# EasyEDA Pro project multi_port.eprj, board PCB1
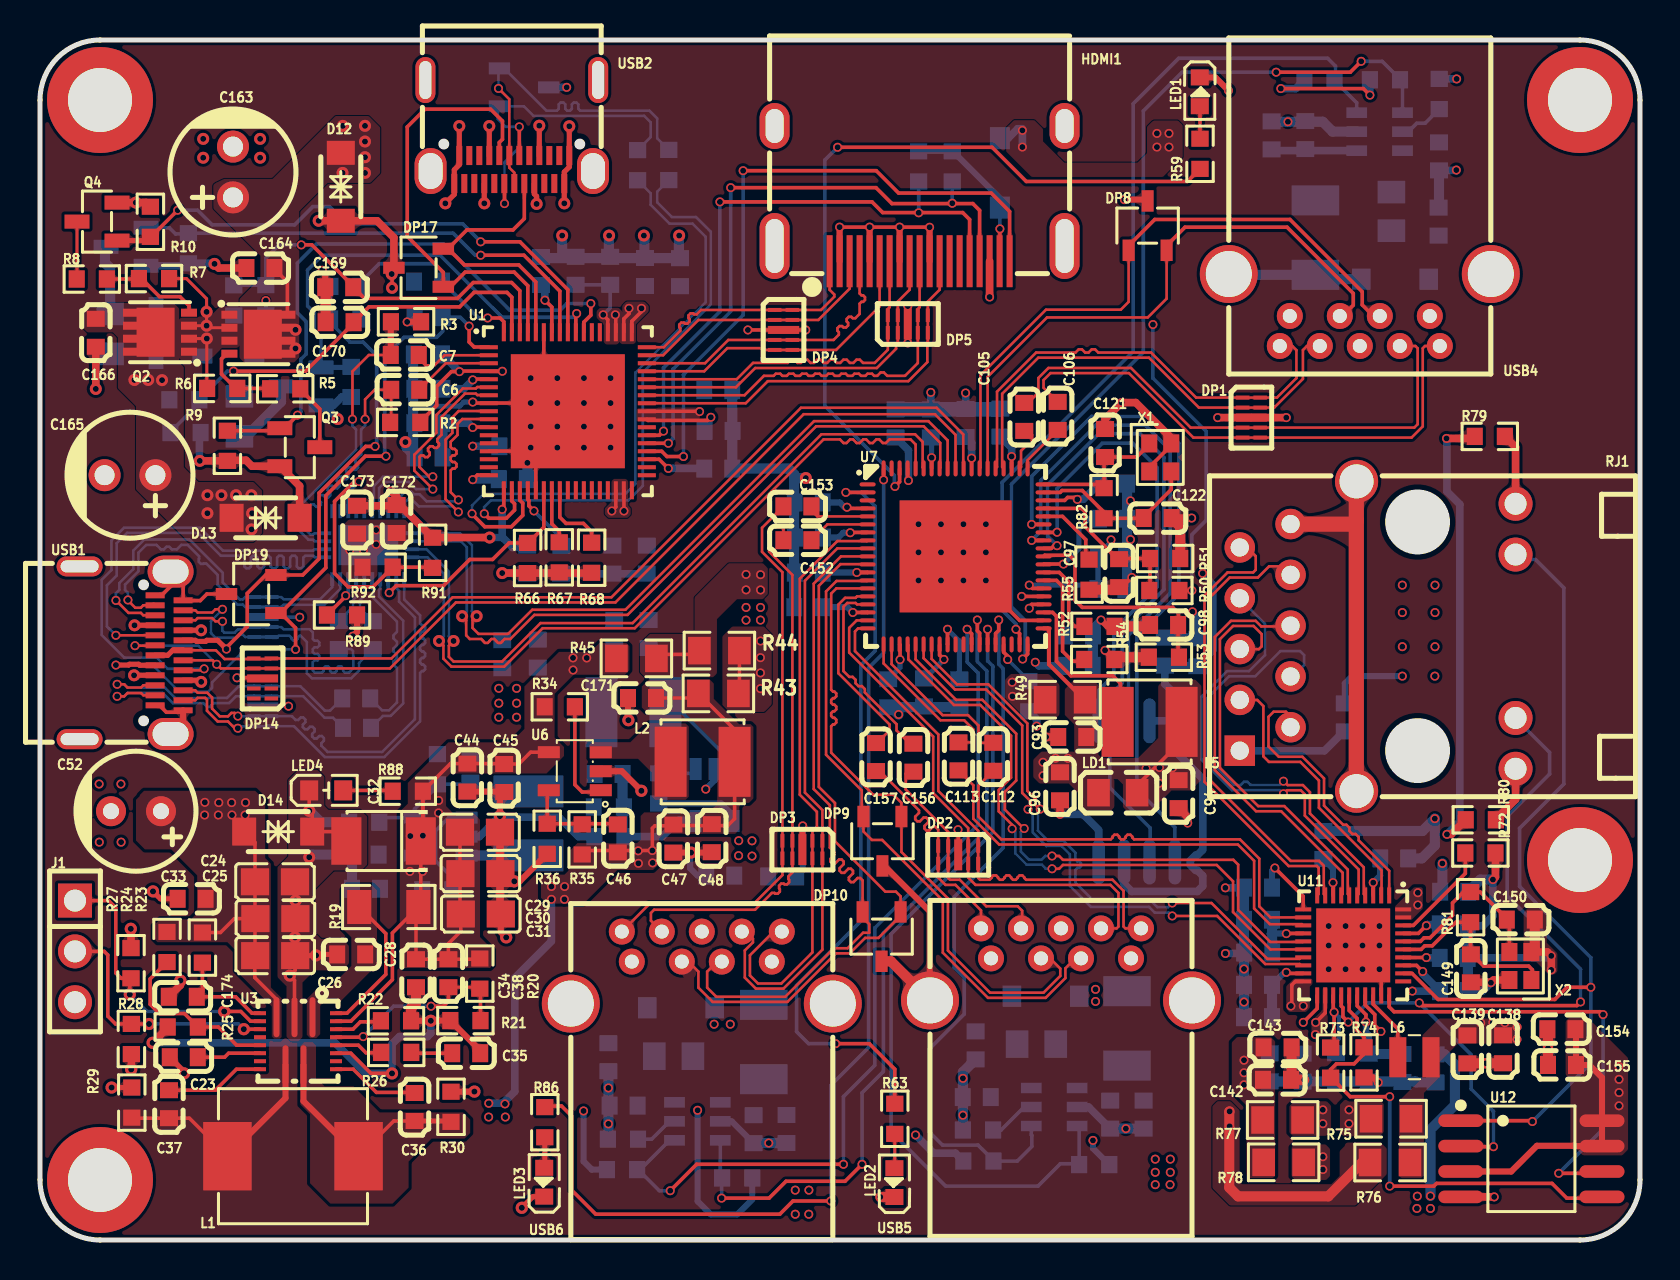
[diagram p4: board, top side]
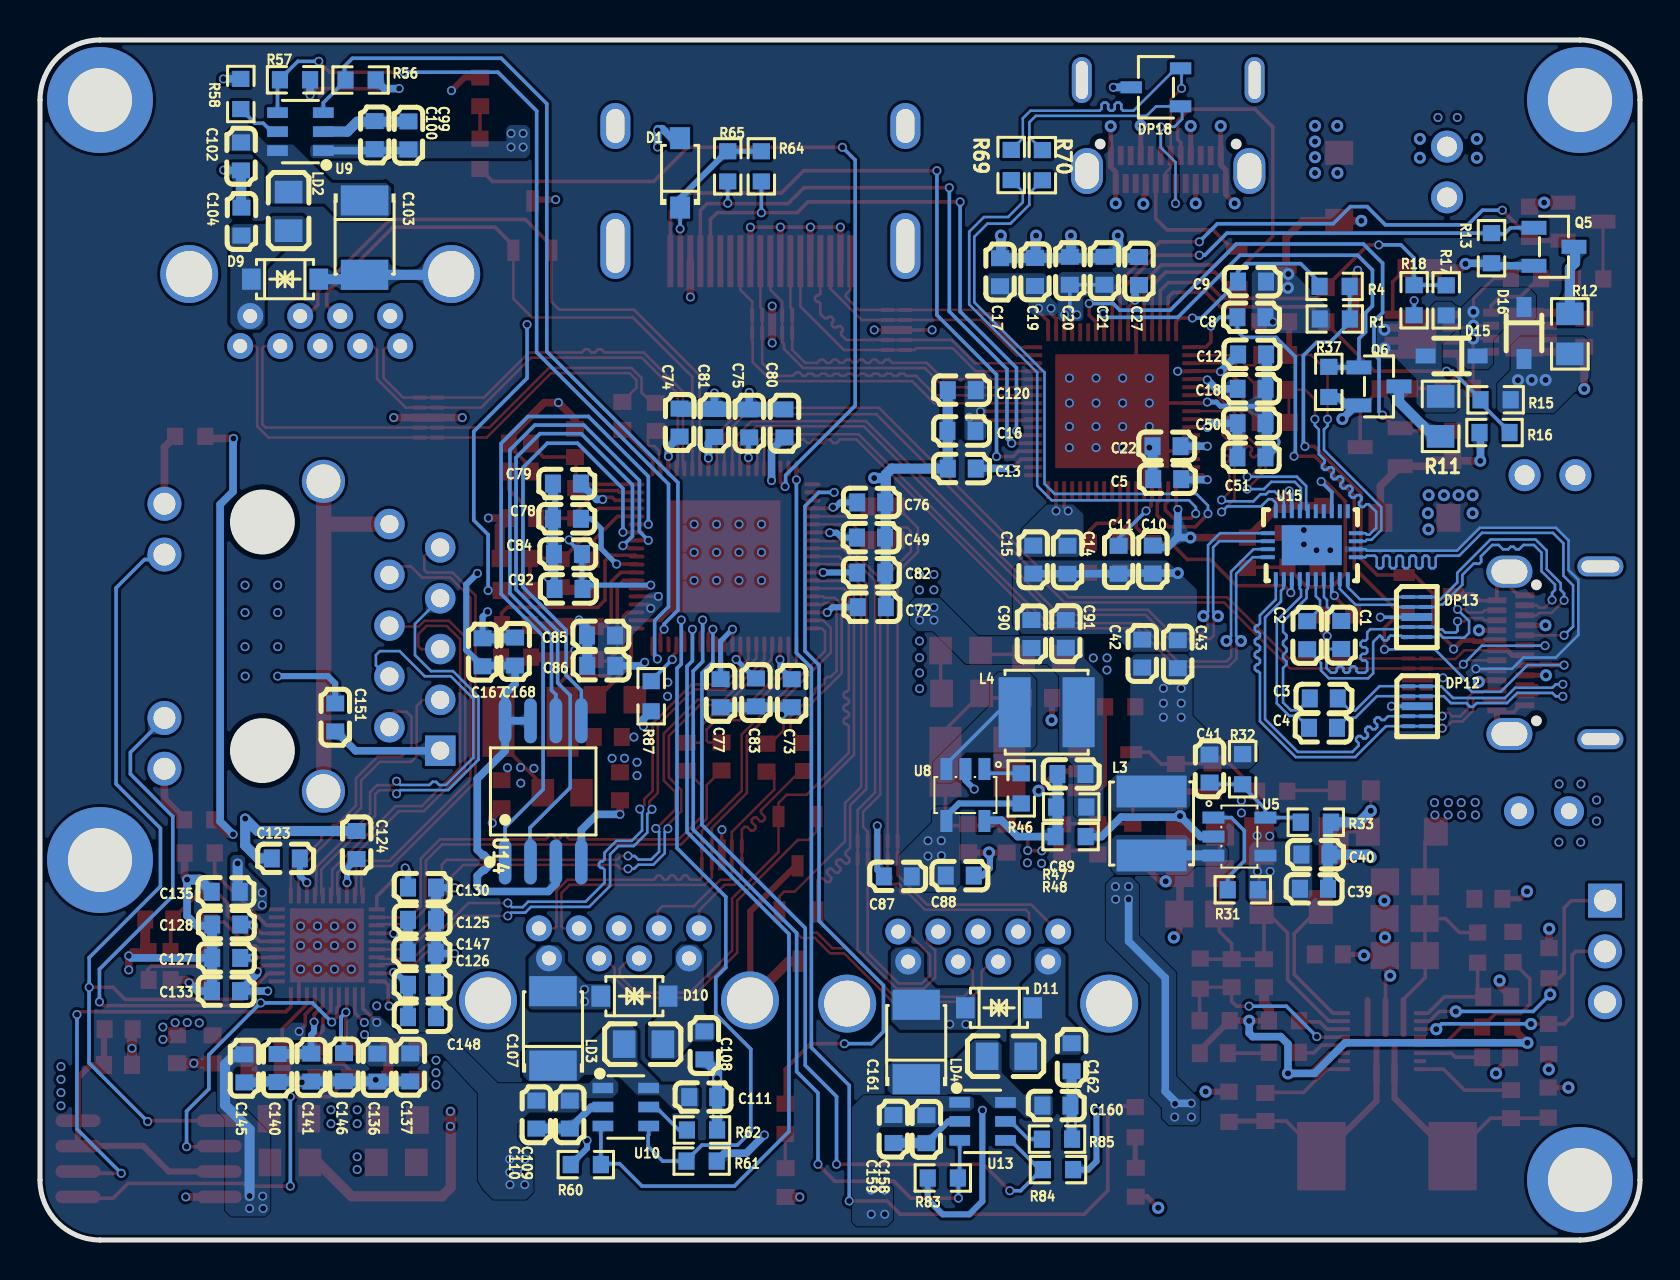
[diagram p5: board, bottom side, seen from below]

Outline 80 x 60 mm; copper layers: Top Layer, GND, POWER, Bottom Layer. Coordinates in mm from the lower left corner of the outline.
Outline path: 0,57 0,3 arc(0.88,0.88) 3,0 77,0 arc(79.12,0.88) 80,3 80,57 arc(79.12,59.12) 77,60 3,60 arc(0.88,59.12) 0,57
Stack: Top Layer 0.035mm 外层铜厚1oz / Dielectric1 0.2104mm 7628 RC49% 8.6mil / GND 0.0152mm 内层铜厚 / Dielectric2 1.065mm 1.1mm H/HOZ Copper / POWER 0.0152mm 内层铜厚 / Dielectric3 0.2104mm 7628 RC49% 8.6mil / Bottom Layer 0.035mm 外层铜厚1oz

## Design rules (mm)
net $1N9521: DP15
net TXN2_UFP: DP3
net $1N9525: DP15
net TXP2_UFP: DP3
net $1N9533: DP14
net TXN1_UFP: DP1
net $1N9529: DP14
net TXP1_UFP: DP1
net AUX_P_UFP: DP7
net CHAUX_P: DP16
net AUX_N_UFP: DP7
net CHAUX_N: DP16
net VDD5.0: VDD5.0
net USB1_TXP: USB1_TX
net U1_TXP: U1_TX
net USB1_TXN: USB1_TX
net U1_TXN: U1_TX
net USB2_TXP: 差分過孔, USB2_TX
net U2_TXP: U2_TX
net USB2_TXN: USB2_TX
net U2_TXN: U2_TX
net USB3_TXP: USB3_TX
net U3_TXP: U3_TX
net USB3_TXN: USB3_TX
net U3_TXN: U3_TX
net USB4_TXP: USB4_TX
net U4_TXP: U4_TX
net USB4_TXN: USB4_TX
net U4_TXN: U4_TX
net RXN1_UFP: RX1_UFP
net RXP1_UFP: RX1_UFP
net RXN2_UFP: DP2
net RXP2_UFP: DP2
net DN_DFP: DP13
net DP_DFP: DP13
net HDMI_D2P: HDMI_D2
net HDMI_D2N: HDMI_D2
net HDMI_D1P: HDMI_D1
net HDMI_D1N: HDMI_D1
net HDMI_D0P: HDMI_D0
net HDMI_D0N: HDMI_D0
net HDMI_CKP: HDMI_CK
net HDMI_CKN: HDMI_CK
net USB1_RXN: USB1_RX
net USB1_RXP: USB1_RX
net USB3_RXN: USB3_RX
net USB3_RXP: USB3_RX
net DM3: DP8
net DP3: DP8
net USB4_RXN: USB4_RX
net USB4_RXP: USB4_RX
net DM4: DP9
net DP4: DP9
net HDI0_P: HDI0_
net HDI0_N: HDI0_
net HDI1_P: HDI1_
net HDI2_P: HDI2_
net HDI2_N: HDI2_
net HDI1_N: HDI1_
net HDI3_P: HDI3_
net HDI3_N: HDI3_
net BB_DN: 差分過孔
net BB_DP: 差分過孔
net LANE0_P: LANE0_
net LANE0_N: LANE0_
net LANE1_P: LANE1_
net LANE1_N: LANE1_
net USB2_RXN: USB2_RX
net USB2_RXP: 差分過孔, USB2_RX
net DP2: 差分過孔, DP10
net DM2: 差分過孔, DP10
net CH_TXN1: DP20
net CH_TXP1: DP20
net CH_RXN1: DP19
net CH_RXP1: DP19
net SBU2: DP17
net SBU1: DP17
template: 自定义配置
spacing copperThickness1oz (default): track to track 0, other pairs 0 to 0
spacing copperThickness2oz: track to track 0.102, other pairs 0.152 to 0.3
spacing safeClearance: track to track 0.127, other pairs 0.127 to 0.3
spacing Contraint: track to track 0.152, other pairs 0 to 0.3
track width copperThickness1oz (default): min 0.127, default 0.18, max 2.54
track width copperThickness2oz: min 0.203, default 0.254, max 2.54
differential pair differentialPair (default): width min 0.119, default 0.13, max 2.54; gap min 0.127, default 0.127
via viaSize (default): diameter min 0.3, default 0.599, max 10; hole min 0.099, default 0.3, max 6.299
via smallsize: diameter min 0.45, default 0.45, max 10; hole min 0.3, default 0.3, max 6.299
net class 差分過孔 uses safeClearance, smallsize
net USB2_TXP uses safeClearance, smallsize
net BB_DN uses safeClearance, smallsize
net BB_DP uses safeClearance, smallsize
net USB2_RXP uses safeClearance, smallsize
net DP2 uses safeClearance, smallsize
net DM2 uses safeClearance, smallsize
['net', 'bb dn'] ['NET', 'BB_DP'] uses safeClearance
['net', 'usb2 rxn'] ['NET', 'USB2_TXP'] uses safeClearance
['net', 'dm2'] ['NET', 'DP2'] uses safeClearance
['net', 'txn2 ufp'] ['NET', 'TXP2_UFP'] uses safeClearance
region e30364 uses Contraint
region e756 uses Contraint, otherClearance
region e1344 uses Contraint
region e1345 uses Contraint, otherClearance

## Placement (name value [footprint] x y rotation side)
C1  100nF  [C0603]  14.94 30.25 90 bottom
C2  100nF  [C0603]  16.64 30.24 90 bottom
C3  100nF  [C0603]  15.81 27.08 0 bottom
C4  100nF  [C0603]  15.85 25.61 0 bottom
C5  100nF  [C0603]  23.64 38.04 0 bottom
C6  100nF  [C0603]  18.26 42.51 0 top
C7  100nF  [C0603]  18.24 44.25 0 top
C8  560pF  [C0603]  19.43 46.14 0 bottom
C9  560pF  [C0603]  19.4 47.92 0 bottom
C10  100nF  [C0603]  24.36 34.02 270 bottom
C11  100nF  [C0603]  26.07 34.01 270 bottom
C12  100nF  [C0603]  19.39 44.28 180 bottom
C13  100nF  [C0603]  33.91 38.57 180 bottom
C14  10μF  [C0603]  28.62 34.02 90 bottom
C15  100nF  [C0603]  30.34 34.02 90 bottom
C16  100nF  [C0603]  33.93 40.45 0 bottom
C17  100nF  [C0603]  32 48.39 270 bottom
C18  100nF  [C0603]  19.42 42.56 180 bottom
C19  100nF  [C0603]  30.25 48.4 270 bottom
C20  100nF  [C0603]  28.51 48.46 270 bottom
C21  100nF  [C0603]  26.78 48.46 270 bottom
C22  4.7μF  [C0603]  23.67 39.69 0 bottom
C23  2.2μF  [C0603]  7.19 9.14 0 top
C24  22μF/50V  [C0805]  11.75 17.91 180 top
C25  22μF/50V  [C0805]  11.77 16.07 180 top
C26  100nF  [C0805]  11.76 14.22 180 top
C27  100nF  [C0603]  25.05 48.45 90 bottom
C28  100nF  [C0603]  15.56 14.28 180 top
C29  22μF/50V  [C0805]  22 20.39 180 top
C30  22μF/50V  [C0805]  22.02 18.32 180 top
C31  22μF/50V  [C0805]  22.04 16.3 180 top
C32  100uF  [CASE-B_3528]  17.18 19.95 180 top
C33  100nF  [C0603]  7.58 17.06 0 top
C34  100nF  [C0603]  18.8 13.34 270 top
C35  22nF  [C0603]  21.31 9.34 180 top
C36  100nF  [C0603]  18.73 6.65 90 top
C37  100nF  [C0603]  6.45 6.79 90 top
C38  33pF  [C0603]  20.42 13.34 90 top
C39  10μF  [C0603]  16.3 17.56 0 bottom
C40  100nF  [C0603]  16.23 19.27 0 bottom
C41  33pF  [C0603]  21.52 23.57 90 bottom
C42  10μF  [C0603]  24.89 29.32 270 bottom
C43  100nF  [C0603]  23.12 29.29 270 bottom
C44  10μF  [C0603]  21.37 23.12 90 top
C45  100nF  [C0603]  23.21 23.1 90 top
C46  33pF  [C0603]  28.89 20.08 270 top
C47  10μF  [C0603]  31.67 20.07 90 top
C48  100nF  [C0603]  33.59 20.09 90 top
C49  100nF  [C0603]  38.45 35.12 0 bottom
C50  100nF  [C0603]  19.42 40.84 180 bottom
C51  4.7μF  [C0603]  19.43 39.13 180 bottom
C52  100uF  [CAP-TH_BD6.0-P2.50-D0.5-FD]  4.8 21.44 180 top
C72  100nF  [C0603]  38.41 31.64 0 bottom
C73  100nF  [C0603]  42.41 27.34 90 bottom
C74  100nF  [C0603]  48.02 40.87 270 bottom
C75  100nF  [C0603]  44.54 40.83 270 bottom
C76  100nF  [C0603]  38.44 36.88 0 bottom
C77  100nF  [C0603]  45.97 27.34 90 bottom
C78  100nF  [C0603]  53.65 36.06 180 bottom
C79  100nF  [C0603]  53.65 37.82 180 bottom
C80  100nF  [C0603]  42.78 40.83 270 bottom
C81  100nF  [C0603]  46.28 40.85 270 bottom
C82  100nF  [C0603]  38.44 33.37 0 bottom
C83  100nF  [C0603]  44.2 27.38 90 bottom
C84  100nF  [C0603]  53.6 34.3 180 bottom
C85  100nF  [C0603]  51.95 30.23 180 bottom
C86  10μF  [C0603]  51.94 28.71 180 bottom
C87  10μF  [C0603]  37.11 18.18 180 bottom
C88  100nF  [C0603]  34.01 18.22 0 bottom
C89  33pF  [C0603]  28.43 23.3 180 bottom
C90  10μF  [C0603]  30.43 30.3 270 bottom
C91  100nF  [C0603]  28.71 30.31 270 bottom
C92  10μF  [C0603]  53.57 32.55 180 bottom
C93  100nF  [C0603]  51.61 25.15 0 top
C94  10μF  [C0603]  56.93 22.29 90 top
C96  10μF  [C0603]  51 22.69 90 top
C97  1μF  [C0603]  53.96 33.34 90 top
C98  1μF  [C0603]  56.2 30.75 0 top
C99  10μF  [C0603]  61.58 55.23 270 bottom
C100  100nF  [C0603]  63.26 55.24 270 bottom
C102  100nF  [C0603]  69.95 54.18 270 bottom
C103  100uF  [CASE-B_3528]  63.77 50.12 270 bottom
C104  100nF  [C0603]  69.93 50.92 270 bottom
C105  100nF  [C0603]  49.21 41.16 90 top
C106  100nF  [C0603]  50.88 41.2 90 top
C107  100uF  [CASE-B_3528]  54.35 10.58 90 bottom
C108  100nF  [C0603]  46.78 9.73 90 bottom
C109  10μF  [C0603]  53.51 6.27 90 bottom
C110  100nF  [C0603]  55.18 6.27 90 bottom
C111  100nF  [C0603]  46.84 7.14 180 bottom
C112  100nF  [C0603]  47.66 24.16 270 top
C113  100nF  [C0603]  45.93 24.18 270 top
C120  100nF  [C0603]  33.91 42.49 180 bottom
C121  20pF  [C0603]  53.25 39.85 270 top
C122  20pF  [C0603]  55.88 36.1 180 top
C123  100nF  [C0603]  67.71 19.08 180 bottom
C124  100nF  [C0603]  64.17 19.75 270 bottom
C125  100nF  [C0603]  60.9 16.01 0 bottom
C126  100nF  [C0603]  60.9 12.76 0 bottom
C127  100nF  [C0603]  70.69 14.11 0 bottom
C128  100nF  [C0603]  70.69 15.77 0 bottom
C130  100nF  [C0603]  60.9 17.62 0 bottom
C133  100nF  [C0603]  70.7 12.45 0 bottom
C135  100nF  [C0603]  70.71 17.41 0 bottom
C136  100nF  [C0603]  63.13 8.62 270 bottom
C137  4.7μF  [C0603]  61.49 8.63 270 bottom
C138  100nF  [C0603]  73.16 9.54 90 top
C139  4.7μF  [C0603]  71.37 9.53 90 top
C140  100nF  [C0603]  68.12 8.6 270 bottom
C141  4.7μF  [C0603]  66.44 8.62 270 bottom
C142  100nF  [C0603]  61.85 8.01 180 top
C143  4.7μF  [C0603]  61.88 9.63 180 top
C145  100nF  [C0603]  69.78 8.58 270 bottom
C146  100nF  [C0603]  64.8 8.64 270 bottom
C147  4.7μF  [C0603]  60.91 14.37 0 bottom
C148  4.7μF  [C0603]  60.9 11.14 0 bottom
C149  20pF  [C0603]  71.54 13.58 90 top
C150  20pF  [C0603]  74.04 16.02 180 top
C151  100nF  [C0603]  65.24 26.13 270 bottom
C152  100nF  [C0603]  37.87 34.99 180 top
C153  100nF  [C0603]  37.87 36.68 180 top
C154  100nF  [C0603]  76.07 10.54 0 top
C155  4.7μF  [C0603]  76.1 8.75 0 top
C156  100nF  [C0603]  43.67 24.12 270 top
C157  100nF  [C0603]  41.8 24.15 270 top
C158  10μF  [C0603]  35.68 5.54 90 bottom
C159  100nF  [C0603]  37.32 5.55 90 bottom
C160  100nF  [C0603]  29.18 6.72 180 bottom
C161  100uF  [CASE-B_3528]  36.19 9.9 90 bottom
C162  100nF  [C0603]  28.42 9.14 90 bottom
C163  100uF  [CAP-TH_BD6.3-P2.50-D1.0-FD]  9.65 53.4 90 top
C164  100nF  [C0603]  11.02 48.6 180 top
C165  100uF  [CAP-TH_BD6.3-P2.50-D1.0-FD]  4.5 38.24 180 top
C166  100nF  [C0603]  2.79 45.36 270 top
C167  100nF  [C0603]  57.87 29.38 270 bottom
C168  4.7μF  [C0603]  56.25 29.42 270 bottom
C169  10nF  [C0603]  14.96 47.64 180 top
C170  10nF  [C0603]  14.98 45.89 180 top
C171  100nF  [C0603]  30.1 27.1 0 top
C172  100nF  [C0603]  17.83 36.05 90 top
C173  10μF  [C0603]  15.85 36.01 90 top
C174  100nF  [C0603]  7.14 12.16 0 top
D1  B5819W  [SOD-123F_L2.7-W1.6-LS3.8-RD-1]  48 53.36 90 bottom
D9  SJD12C06L01  [SOD-123_L2.8-W1.8-LS3.7-BI]  67.75 48.04 180 bottom
D10  SJD12C06L01  [SOD-123_L2.8-W1.8-LS3.7-BI]  50.28 12.19 0 bottom
D11  SJD12C06L01  [SOD-123_L2.8-W1.8-LS3.7-BI]  32.05 11.61 0 bottom
D12  SMF22CA  [SOD-123FL_L2.8-W1.8-LS3.7-BI]  15.04 52.66 90 top
D13  SMF22CA  [SOD-123FL_L2.8-W1.8-LS3.7-BI]  11.28 36.11 180 top
D14  SMF22CA  [SOD-123FL_L2.8-W1.8-LS3.7-BI]  11.91 20.42 180 top
D15  1N5819WS  [SOD-323_L1.6-W1.3-LS2.6-RD-1]  9.42 44.2 0 bottom
D16  1N5819WS  [SOD-323_L1.6-W1.3-LS2.6-RD-1]  5.8 45.35 270 bottom
DP1  ULC0524P  [DSON-10_L2.5-W1.0-P0.50-BL]  60.57 41.12 270 top
DP2  ULC0524P  [DSON-10_L2.5-W1.0-P0.50-BL]  45.91 19.26 180 top
DP3  ULC0524P  [DSON-10_L2.5-W1.0-P0.50-BL]  38.12 19.52 180 top
DP4  ULC0524P  [DSON-10_L2.5-W1.0-P0.50-BL]  37.18 45.5 270 top
DP5  ULC0524P  [DSON-10_L2.5-W1.0-P0.50-BL]  43.39 45.8 0 top
DP8  PESD5V0U2BT,215  [SOT-23-3_L2.9-W1.6-P1.90-LS2.8-BR]  55.38 50.72 270 top
DP9  PESD5V0U2BT,215  [SOT-23-3_L2.9-W1.6-P1.90-LS2.8-BR]  42.12 19.94 90 top
DP10  PESD5V0U2BT,215  [SOT-23-3_L2.9-W1.6-P1.90-LS2.8-BR]  42.08 15.17 90 top
DP12  ULC0524P  [DSON-10_L2.5-W1.0-P0.50-BL]  11.14 26.69 270 bottom
DP13  ULC0524P  [DSON-10_L2.5-W1.0-P0.50-BL]  11.16 31.15 270 bottom
DP14  ULC0524P  [DSON-10_L2.5-W1.0-P0.50-BL]  11.13 28.08 90 top
DP17  PESD5V0U2BT,215  [SOT-23-3_L2.9-W1.6-P1.90-LS2.8-BR]  18.93 48.61 0 top
DP18  PESD5V0U2BT,215  [SOT-23-3_L2.9-W1.6-P1.90-LS2.8-BR]  24.2 57.63 180 bottom
DP19  PESD5V0U2BT,215  [SOT-23-3_L2.9-W1.6-P1.90-LS2.8-BR]  10.56 32.3 0 top
HDMI1  HDMI 19PIN 043  [HDMI-SMD_HDMI-19PIN-043]  43.98 52.32 180 top
J1  PZ254V-11-03P  [HDR-TH_3P-P2.54-V-M]  1.75 14.43 270 top
L1  4.7uH  [IND-SMD_L7.3-W6.6]  12.65 4.19 180 top
L2  4.7uH  [IND-SMD_L4.0-W4.0]  33.13 23.91 0 top
L3  4.7uH  [IND-SMD_L4.0-W4.0]  24.42 20.83 90 bottom
L4  4.7uH  [IND-SMD_L4.0-W4.0]  29.67 26.39 180 bottom
L5  4.7uH  [IND-SMD_L4.0-W4.0]  55.48 25.91 0 top
L6  2.2uH  [IND-SMD_L2.5-W2.0-VLS252012CX-150M]  68.72 9.14 0 top
LD1  BLM21PG221SN1D  [L0805]  53.89 22.37 180 top
LD2  BLM21PG221SN1D  [L0805]  67.57 51.43 270 bottom
LD3  BLM21PG221SN1D  [L0805]  49.82 9.79 180 bottom
LD4  BLM21PG221SN1D  [L0805]  31.68 9.19 180 bottom
LED1  19-217/BHC-ZL1M2RY/3T  [LED0603-FD_BLUE]  57.99 57.41 270 top
LED2  19-217/BHC-ZL1M2RY/3T  [LED0603-FD_BLUE]  42.72 2.87 90 top
LED3  19-217/BHC-ZL1M2RY/3T  [LED0603-FD_BLUE]  25.21 2.89 90 top
LED4  NCD0603G1  [LED0603-RD_1]  14.31 22.48 0 top
NOREF  -  [Pad_e204]  3 57 0 top
NOREF#2  -  [Pad_e206]  3 3 0 top
NOREF#3  -  [Pad_e236]  77 19 0 top
NOREF#4  -  [Pad_e207]  77 57 0 top
Q1  SM3303PSQGC-TRG  [WDFN-8_L3.0-W3.0-P0.65-BL]  10.92 45.29 270 top
Q2  SM3303PSQGC-TRG  [WDFN-8_L3.0-W3.0-P0.65-BL]  6 45.39 90 top
Q3  2N7002  [SOT-23-3_L2.9-W1.3-P1.90-LS2.4-BR]  12.99 39.64 180 top
Q4  2N7002  [SOT-23-3_L2.9-W1.3-P1.90-LS2.4-BR]  2.85 50.92 0 top
Q5  2N7002  [SOT-23-3_L2.9-W1.3-P1.90-LS2.4-BR]  4.3 49.66 0 bottom
Q6  2N7002  [SOT-23-3_L2.9-W1.3-P1.90-LS2.4-BR]  13.05 42.68 0 bottom
R1  1K/NC  [R0603]  15.26 46.05 180 bottom
R2  1M  [R0603]  18.26 40.88 0 top
R3  1M  [R0603]  18.3 45.91 180 top
R4  0R  [R0603]  15.27 47.68 0 bottom
R5  10K  [R0603]  12.26 42.56 180 top
R6  100K  [R0603]  9.11 42.58 0 top
R7  100K  [R0603]  5.7 48.07 180 top
R8  10K  [R0603]  2.59 48.05 0 top
R9  10K  [R0603]  9.37 39.71 90 top
R10  10K  [R0603]  5.52 50.91 270 top
R11  200R  [R0805]  9.97 41.18 90 bottom
R12  200R  [R0805]  3.51 45.31 270 bottom
R13  10K  [R0603]  7.42 49.59 90 bottom
R15  330K 0.1%  [R0603]  7.22 42.01 180 bottom
R16  47K 0.1%  [R0603]  7.27 40.37 180 bottom
R17  330K 0.1%  [R0603]  9.69 46.98 270 bottom
R18  47K 0.1%  [R0603]  11.29 46.99 90 bottom
R19  0.01R  [R1206]  17.44 16.65 0 top
R20  100K 1%  [R0603]  21.99 13.32 90 top
R21  24K 1%  [R0603]  21.27 10.97 0 top
R22  39K  [R0603]  17.8 10.96 180 top
R23  150K  [R0603]  8.12 14.62 90 top
R24  75K  [R0603]  6.35 14.65 90 top
R25  28K  [R0603]  7.14 10.65 0 top
R26  10K  [R0603]  17.81 9.38 0 top
R27  10K  [R0603]  4.55 13.84 270 top
R28  10K  [R0603]  4.57 10.05 90 top
R29  10K  [R0603]  4.59 6.87 270 top
R30  10K  [R0603]  20.55 6.66 90 top
R31  100K  [R0603]  19.86 17.51 0 bottom
R32  110K 1%  [R0603]  19.87 23.54 90 bottom
R33  150K 1%  [R0603]  16.21 20.89 180 bottom
R34  100K  [R0603]  25.99 26.66 0 top
R35  680K 1%  [R0603]  27.11 20.03 270 top
R36  150K 1%  [R0603]  25.36 20.06 270 top
R37  10K  [R0603]  15.56 42.9 90 bottom
R43  0R  [R0805]  33.92 27.33 180 top
R44  0R  [R0805]  33.97 29.47 0 top
R45  0R/NC  [R0805]  29.82 29.08 180 top
R46  100K  [R0603]  30.94 22.58 90 bottom
R47  100K 1%  [R0603]  28.44 21.65 180 bottom
R48  110K 1%  [R0603]  28.47 20.17 180 bottom
R49  0R  [R0805]  51.25 27.01 180 top
R50  5.1K  [R0603]  56.22 32.47 0 top
R51  10K  [R0603]  56.26 34.08 180 top
R52  20K  [R0603]  52.97 30.68 0 top
R53  10K  [R0603]  56.19 29.14 180 top
R54  10K  [R0603]  52.96 29.03 180 top
R55  100K  [R0603]  52.45 33.27 270 top
R56  100K  [R0603]  63.97 58 0 bottom
R57  10K  [R0603]  67.25 58.01 180 bottom
R58  18K 1%  [R0603]  69.96 57.3 90 bottom
R59  5.1K  [R0603]  58 54.31 90 top
R60  100K  [R0603]  52.71 3.77 180 bottom
R61  10K  [R0603]  46.92 3.95 180 bottom
R62  18K 1%  [R0603]  46.9 5.5 180 bottom
R63  5.1K  [R0603]  42.74 6.06 270 top
R64  1.8k  [R0603]  43.93 53.68 270 bottom
R65  1.8k  [R0603]  45.61 53.68 270 bottom
R66  4.7K  [R0603]  24.38 34.1 90 top
R67  10K/NC  [R0603]  25.96 34.13 90 top
R68  10K/NC  [R0603]  27.58 34.11 90 top
R69  0R  [R0603]  31.44 53.75 270 bottom
R70  0R  [R0603]  29.88 53.74 270 bottom
R72  2.49K 1%  [R0603]  72.02 19.35 0 top
R73  10K  [R0603]  64.53 8.87 90 top
R74  10K/NC  [R0603]  66.2 8.88 270 top
R75  0R/NC  [R0805]  67.55 6.06 0 top
R76  0R/NC  [R0805]  67.5 3.87 0 top
R77  0R  [R0805]  62.13 6 180 top
R78  0R/NC  [R0805]  62.18 3.88 180 top
R79  470R  [R0603]  72.49 40.18 180 top
R80  470R  [R0603]  72.04 21.01 180 top
R81  1M  [R0603]  71.53 16.64 90 top
R82  1M  [R0603]  53.2 36.84 270 top
R83  100K  [R0603]  34.86 3.1 180 bottom
R84  10K  [R0603]  29.1 3.52 180 bottom
R85  18K 1%  [R0603]  29.15 5.04 180 bottom
R86  5.1K  [R0603]  25.24 5.89 270 top
R87  10K  [R0603]  49.44 27.19 90 bottom
R88  10K  [R0603]  18.39 22.44 0 top
R89  10K  [R0603]  15.1 31.25 0 top
R91  20K  [R0603]  19.63 34.36 90 top
R92  20K  [R0603]  16.88 33.64 180 top
RJ1  HR911130A  [RJ45-TH_HR911130A]  66.88 30.19 270 top
U1  CS5266AN  [QFN-68_L8.0-W8.0-P0.40-TL-EP5.7]  26.39 41.44 0 top
U3  SC8721QFER  [QFN-21_L4.0-W4.0-P0.40-BL_SC8721QFER]  12.9 9.94 180 top
U5  TD6810C  [SOT-23-5_L3.0-W1.7-P0.95-LS2.8-BR]  20.03 20.17 0 bottom
U6  TD6810C  [SOT-23-5_L3.0-W1.7-P0.95-LS2.8-BR]  26.74 23.44 0 top
U7  GL3523-OTY30  [QFN-76_L9.0-W9.0-P0.40-BL-EP]  45.78 34.18 270 top
U8  TD6810C  [SOT-23-5_L3.0-W1.7-P0.95-LS2.8-BR]  33.73 22.25 90 bottom
U9  AP2552W6-7  [SOT-26_L3.0-W1.6-P0.95-LS2.8-BL]  66.98 55.42 90 bottom
U10  AP2552W6-7  [SOT-26_L3.0-W1.6-P0.95-LS2.8-BL]  50.71 6.65 270 bottom
U11  RTL8153B-VB-CG  [QFN-40_L5.0-W5.0-P0.40-BL-EP3.7]  65.66 14.73 180 top
U12  W25Q32JVSSIQ  [SOIC-8_L5.3-W5.3-P1.27-LS8.0-BL]  74.57 4.06 270 top
U13  AP2552W6-7  [SOT-26_L3.0-W1.6-P0.95-LS2.8-BL]  32.87 5.93 270 bottom
U14  W25Q32JVSSIQ  [SOIC-8_L5.3-W5.3-P1.27-LS8.0-BL]  54.84 22.43 180 bottom
U15  VL170  [MQFN-28_L4.5-W3.5-P0.40-BL-EP]  16.41 34.74 180 bottom
USB1  TYPE-C 24P QT 143  [TYPE-C-SMD_C9900025773]  4.57 29.36 270 top
USB2  TYPE-C 24P QT 143  [TYPE-C-SMD_C9900025773]  23.59 55.41 180 top
USB4  U231-091N-1BLRC19-F1  [USB-3.0-TH_XKB_U231-091N-1BLRC19-F1]  65.99 46.5 180 top
USB5  U231-091N-1BLRC19-F1  [USB-3.0-TH_XKB_U231-091N-1BLRC19-F1]  51.05 13.78 0 top
USB6  U231-091N-1BLRC19-F1  [USB-3.0-TH_XKB_U231-091N-1BLRC19-F1]  33.09 13.62 0 top
X1  25M  [CRYSTAL-SMD_4P-L2.0-W1.6-BL]  56.01 39.13 270 top
X2  25M  [CRYSTAL-SMD_4P-L2.0-W1.6-BL]  74.02 13.7 90 top

## Footprints (pads in the part's own frame, mm; a bottom-side part is the same pattern mirrored in y, then rotated)
C0603
  rect 0.8x0.9 smd: 1(-0.7,0) 2(0.7,0)
C0805
  rect 1.41x1.35 smd: 1(-1,0) 2(1,0)
CAP-TH_BD6.0-P2.50-D0.5-FD
  round 1.5 hole 0.8: 1(-1.25,0) 2(1.25,0)
CAP-TH_BD6.3-P2.50-D1.0-FD
  round 1.6 hole 1: 1(-1.27,0) 2(1.27,0)
CASE-B_3528
  rect 1.506x2.376 smd: 1(-1.861,0) 2(1.861,0)
CRYSTAL-SMD_4P-L2.0-W1.6-BL
  rect 0.9x0.8 smd: 1(-0.7,-0.55) 2(0.7,-0.55) 3(0.7,0.55) 4(-0.7,0.55)
DSON-10_L2.5-W1.0-P0.50-BL
  rect 0.2x0.675 smd: 1(-1,-0.438) 2(-0.5,-0.438) 4(0.5,-0.438) 5(1,-0.438) 6(1,0.438) 7(0.5,0.438) 9(-0.5,0.438) 10(-1,0.438)
  rect 0.4x1.55 smd: 3-8(0,0)
HDMI-SMD_HDMI-19PIN-043
  rect 0.3x2.6 smd: 1(4.5,3.38) 2(4,3.38) 3(3.5,3.38) 4(3,3.38) 5(2.5,3.38) 6(2,3.38) 7(1.5,3.38) 8(1,3.38) 9(0.5,3.38) 10(0,3.38) 11(-0.5,3.38) 12(-1,3.38) 13(-1.5,3.38) 14(-2,3.38) 15(-2.5,3.38) 16(-3,3.38) 17(-3.5,3.38) 18(-4,3.38) 19(-4.5,3.38)
  oval 1.5x3.3 hole 0.9x2.7: 20(-7.25,2.62) 20(7.25,2.62)
  oval 1.5x2.3 hole 0.9x1.7: 20(-7.25,-3.38) 20(7.25,-3.38)
HDR-TH_3P-P2.54-V-M
  rect 1.7x1.7 hole 1.1: 1(-2.54,0)
  round 1.7 hole 1.1: 2(0,0) 3(2.54,0)
IND-SMD_L2.5-W2.0-VLS252012CX-150M
  rect 0.85x2 smd: 1(-0.83,0) 2(0.83,0)
IND-SMD_L4.0-W4.0
  rect 1.6x3.5 smd: 1(-1.6,0) 2(1.6,0)
IND-SMD_L7.3-W6.6
  rect 2.424x3.42 smd: 1(3.278,0) 2(-3.278,0)
L0805
  rect 1.133x1.377 smd: 1(-0.966,0) 2(0.966,0)
LED0603-FD_BLUE
  rect 0.8x0.9 smd: 1(-0.72,0) 2(0.72,0)
LED0603-RD_1
  rect 0.9x1 smd: 1(-0.85,0) 2(0.85,0)
MQFN-28_L4.5-W3.5-P0.40-BL-EP
  rect 0.2x0.7 smd: 1(-1.8,-1.7) 2(-1.4,-1.7) 3(-1,-1.7) 4(-0.6,-1.7) 5(-0.2,-1.7) 6(0.2,-1.7) 7(0.6,-1.7) 8(1,-1.7) 9(1.4,-1.7) 10(1.8,-1.7) 15(1.8,1.7) 16(1.4,1.7) 17(1,1.7) 18(0.6,1.7) 19(0.2,1.7) 20(-0.2,1.7) 21(-0.6,1.7) 22(-1,1.7) 23(-1.4,1.7) 24(-1.8,1.7)
  rect 0.7x0.2 smd: 11(2.2,-0.6) 12(2.2,-0.2) 13(2.2,0.2) 14(2.2,0.6) 25(-2.2,0.6) 26(-2.2,0.2) 27(-2.2,-0.2) 28(-2.2,-0.6)
  rect 3x2 smd: 29(0,0)
Pad_e204
  round 5.3 hole 3.2: 1(0,0)
Pad_e206
  round 5.3 hole 3.2: 1(0,0)
Pad_e207
  round 5.3 hole 3.2: 1(0,0)
Pad_e236
  round 5.3 hole 3.2: 1(0,0)
QFN-21_L4.0-W4.0-P0.40-BL_SC8721QFER
  oval 0.3x2 smd: 1(-0.725,-1.2) 2(0.175,-1.2) 3(1.075,-1.2) 12(0.625,1.2) 13(-0.275,1.2)
  rect 0.6x0.2 smd: 4(1.9,-1.4) 5(1.9,-1) 6(1.9,-0.6) 7(1.9,-0.2) 8(1.9,0.2) 9(1.9,0.6) 10(1.9,1) 11(1.9,1.4) 14(-1.9,1.4) 15(-1.9,1) 16(-1.9,0.6) 17(-1.9,0.2) 18(-1.9,-0.2) 19(-1.9,-0.6) 20(-1.9,-1) 21(-1.9,-1.4)
QFN-40_L5.0-W5.0-P0.40-BL-EP3.7
  rect 0.2x0.8 smd: 1(-1.8,-2.499) 2(-1.4,-2.499) 3(-1,-2.499) 4(-0.6,-2.499) 5(-0.2,-2.499) 6(0.2,-2.499) 7(0.6,-2.499) 8(1,-2.499) 9(1.4,-2.499) 10(1.8,-2.499) 21(1.8,2.499) 22(1.4,2.499) 23(1,2.499) 24(0.6,2.499) 25(0.2,2.499) 26(-0.2,2.499) 27(-0.6,2.499) 28(-1,2.499) 29(-1.4,2.499) 30(-1.8,2.499)
  rect 0.8x0.2 smd: 11(2.499,-1.8) 12(2.499,-1.4) 13(2.499,-1) 14(2.499,-0.6) 15(2.499,-0.2) 16(2.499,0.2) 17(2.499,0.6) 18(2.499,1) 19(2.499,1.4) 20(2.499,1.8) 31(-2.499,1.8) 32(-2.499,1.4) 33(-2.499,1) 34(-2.499,0.6) 35(-2.499,0.2) 36(-2.499,-0.2) 37(-2.499,-0.6) 38(-2.499,-1) 39(-2.499,-1.4) 40(-2.499,-1.8)
  rect 3.7x3.7 smd: 41(0,0)
QFN-68_L8.0-W8.0-P0.40-TL-EP5.7
  rect 0.9x0.2 smd: 1(-3.95,3.2) 2(-3.95,2.8) 3(-3.95,2.4) 4(-3.95,2) 5(-3.95,1.6) 6(-3.95,1.2) 7(-3.95,0.8) 8(-3.95,0.4) 9(-3.95,0) 10(-3.95,-0.4) 11(-3.95,-0.8) 12(-3.95,-1.2) 13(-3.95,-1.6) 14(-3.95,-2) 15(-3.95,-2.4) 16(-3.95,-2.8) 17(-3.95,-3.2) 35(3.95,-3.2) 36(3.95,-2.8) 37(3.95,-2.4) 38(3.95,-2) 39(3.95,-1.6) 40(3.95,-1.2) 41(3.95,-0.8) 42(3.95,-0.4) 43(3.95,0) 44(3.95,0.4) 45(3.95,0.8) 46(3.95,1.2) 47(3.95,1.6) 48(3.95,2) 49(3.95,2.4) 50(3.95,2.8) 51(3.95,3.2)
  rect 0.2x0.9 smd: 18(-3.2,-3.95) 19(-2.8,-3.95) 20(-2.4,-3.95) 21(-2,-3.95) 22(-1.6,-3.95) 23(-1.2,-3.95) 24(-0.8,-3.95) 25(-0.4,-3.95) 26(0,-3.95) 27(0.4,-3.95) 28(0.8,-3.95) 29(1.2,-3.95) 30(1.6,-3.95) 31(2,-3.95) 32(2.4,-3.95) 33(2.8,-3.95) 34(3.2,-3.95) 52(3.2,3.95) 53(2.8,3.95) 54(2.4,3.95) 55(2,3.95) 56(1.6,3.95) 57(1.2,3.95) 58(0.8,3.95) 59(0.4,3.95) 60(0,3.95) 61(-0.4,3.95) 62(-0.8,3.95) 63(-1.2,3.95) 64(-1.6,3.95) 65(-2,3.95) 66(-2.4,3.95) 67(-2.8,3.95) 68(-3.2,3.95)
  rect 5.7x5.7 smd: 69(0,0)
QFN-76_L9.0-W9.0-P0.40-BL-EP
  oval 0.2x0.8 smd: 1(-3.6,-4.399) 2(-3.2,-4.399) 3(-2.8,-4.399) 4(-2.4,-4.399) 5(-2,-4.399) 6(-1.6,-4.399) 7(-1.2,-4.399) 8(-0.8,-4.399) 9(-0.4,-4.399) 10(0,-4.399) 11(0.4,-4.399) 12(0.8,-4.399) 13(1.2,-4.399) 14(1.6,-4.399) 15(2,-4.399) 16(2.4,-4.399) 17(2.8,-4.399) 18(3.2,-4.399) 19(3.6,-4.399) 39(3.6,4.399) 40(3.2,4.399) 41(2.8,4.399) 42(2.4,4.399) 43(2,4.399) 44(1.6,4.399) 45(1.2,4.399) 46(0.8,4.399) 47(0.4,4.399) 48(0,4.399) 49(-0.4,4.399) 50(-0.8,4.399) 51(-1.2,4.399) 52(-1.6,4.399) 53(-2,4.399) 54(-2.4,4.399) 55(-2.8,4.399) 56(-3.2,4.399) 57(-3.6,4.399)
  oval 0.8x0.2 smd: 20(4.399,-3.6) 21(4.399,-3.2) 22(4.399,-2.8) 23(4.399,-2.4) 24(4.399,-2) 25(4.399,-1.6) 26(4.399,-1.2) 27(4.399,-0.8) 28(4.399,-0.4) 29(4.399,0) 30(4.399,0.4) 31(4.399,0.8) 32(4.399,1.2) 33(4.399,1.6) 34(4.399,2) 35(4.399,2.4) 36(4.399,2.8) 37(4.399,3.2) 38(4.399,3.6) 58(-4.399,3.6) 59(-4.399,3.2) 60(-4.399,2.8) 61(-4.399,2.4) 62(-4.399,2) 63(-4.399,1.6) 64(-4.399,1.2) 65(-4.399,0.8) 66(-4.399,0.4) 67(-4.399,0) 68(-4.399,-0.4) 69(-4.399,-0.8) 70(-4.399,-1.2) 71(-4.399,-1.6) 72(-4.399,-2) 73(-4.399,-2.4) 74(-4.399,-2.8) 75(-4.399,-3.2) 76(-4.399,-3.6)
  rect 5.6x5.6 smd: 77(-0.001,0.001)
R0603
  rect 0.806x0.864 smd: 1(-0.753,0) 2(0.753,0)
R0805
  rect 1.133x1.377 smd: 1(-1,0) 2(1,0)
R1206
  rect 1.208x1.701 smd: 1(-1.479,0) 2(1.479,0)
RJ45-TH_HR911130A
  round 1.7 hole 1.1: 11(6.625,6.895) 12(4.085,6.895) 13(-4.085,6.895) 14(-6.625,6.895)
  rect 1.524x1.524 hole 0.91: P1(5.72,-6.895)
  round 1.524 hole 0.91: P2(4.549,-4.355) P3(3.18,-6.895) P4(2.009,-4.355) P5(0.64,-6.895) P6(-0.531,-4.355) P7(-1.9,-6.895) P8(-3.071,-4.355) P9(-4.44,-6.895) P10(-5.611,-4.355)
  round 2.159 hole 1.7: SHIELD0(-7.745,-1.056) SHIELD1(7.745,-1.056)
SOD-123_L2.8-W1.8-LS3.7-BI
  rect 0.93x1.06 smd: 1(1.685,0) 2(-1.685,0)
SOD-123F_L2.7-W1.6-LS3.8-RD-1
  rect 1.1x1 smd: 1(-1.735,0) 2(1.735,0)
SOD-123FL_L2.8-W1.8-LS3.7-BI
  rect 1.2x1.4 smd: 1(-1.7,0) 2(1.7,0)
SOD-323_L1.6-W1.3-LS2.6-RD-1
  rect 1x0.75 smd: 1(-1.3,0) 2(1.3,0)
SOIC-8_L5.3-W5.3-P1.27-LS8.0-BL
  oval 0.63x2.25 smd: 1(-1.905,-3.53) 2(-0.635,-3.53) 3(0.635,-3.53) 4(1.905,-3.53) 5(1.905,3.53) 6(0.635,3.53) 7(-0.635,3.53) 8(-1.905,3.53)
SOT-23-3_L2.9-W1.3-P1.90-LS2.4-BR
  rect 1.25x0.7 smd: 1(1,-0.95) 2(1,0.95) 3(-1,0)
SOT-23-3_L2.9-W1.6-P1.90-LS2.8-BR
  rect 1.07x0.6 smd: 1(1.235,-0.95) 2(1.235,0.95) 3(-1.235,0)
SOT-23-5_L3.0-W1.7-P0.95-LS2.8-BR
  rect 1.1x0.6 smd: 1(1.3,-0.95) 2(1.3,0) 3(1.3,0.95) 4(-1.3,0.95) 5(-1.3,-0.95)
SOT-26_L3.0-W1.6-P0.95-LS2.8-BL
  rect 0.532x1.04 smd: 1(-0.95,-1.145) 2(0,-1.145) 3(0.95,-1.145) 4(0.95,1.145) 5(0,1.145) 6(-0.95,1.145)
TYPE-C-SMD_C9900025773
  oval 1x2.3 hole 0.6x1.9: 15(-4.32,-2.588) 16(4.32,-2.588)
  oval 1.6x2.3 hole 1.2x1.8: 17(4.06,1.962) 18(-4.06,1.962)
  rect 0.3x0.95 smd: A1(-2.625,2.588) A2(-2.125,2.588) A3(-1.625,2.588) A4(-1.125,2.588) A5(-0.625,2.588) A6(-0.125,2.588) A7(0.375,2.588) A8(0.875,2.588) A9(1.375,2.588) A10(1.875,2.588) A11(2.375,2.588) A12(2.875,2.588) B1(2.625,1.188) B2(2.125,1.188) B3(1.625,1.188) B4(1.125,1.188) B5(0.625,1.188) B6(0.125,1.188) B7(-0.375,1.188) B8(-0.875,1.188) B9(-1.375,1.188) B10(-1.875,1.188) B11(-2.375,1.188) B12(-2.875,1.188)
USB-3.0-TH_XKB_U231-091N-1BLRC19-F1
  round 1.3 hole 0.7: 1(-3.5,0.3) 2(-1,0.3) 3(1,0.3) 4(3.5,0.3) 5(4,1.8) 6(2,1.8) 7(0,1.8) 8(-2,1.8) 9(-4,1.8)
  round 2.9 hole 2.3: 10(-6.55,-1.8) 11(6.55,-1.8)
WDFN-8_L3.0-W3.0-P0.65-BL
  rect 0.4x0.8 smd: 1(-0.975,-1.45) 2(-0.325,-1.45) 3(0.325,-1.45) 4(0.975,-1.45) 5(0.975,1.45) 6(0.325,1.45) 7(-0.325,1.45) 8(-0.975,1.45)
  rect 2.45x1.9 smd: 9(0,0.22)

## Nets
As in the schematic, except:
AGND: C5.2 C8.1 C9.1 C10.2 C11.2 C12.2 C13.1 C14.1 C15.1 C16.2 C17.1 C18.2 C19.1 C20.1 C21.1 C22.2 C23.1 C24.1 C25.1 C26.1 C27.2 C28.2 C29.1 C30.1 C31.1 C32.2 C33.1 C34.2 C35.1 C39.1 C40.1 C42.1 C43.1 C44.1 C45.1 C47.1 C48.1 C49.1 C50.2 C51.2 C52.2 C72.1 C73.1 C74.1 C75.1 C76.1 C77.1 C78.1 C79.1 C80.1 C81.1 C82.1 C83.1 C84.1 C85.1 C86.1 C87.1 C88.1 C90.1 C91.1 C92.1 C93.1 C94.1 C96.1 C97.1 C98.1 C99.1 C100.1 C102.2 C103.2 C104.1 C107.2 C108.1 C109.1 C110.1 C111.2 C120.1 C121.1 C122.1 C123.1 C124.1 C125.1 C126.1 C127.2 C128.2 C130.1 C133.2 C135.2 C136.2 C137.2 C138.1 C139.1 C140.2 C141.2 C142.1 C143.1 C145.2 C146.2 C147.1 C148.1 C149.1 C150.1 C151.1 C154.1 C155.1 C158.1 C159.1 C160.2 C161.2 C162.1 C163.2 C164.2 C165.2 C166.2 C167.1 C168.1 C169.2 C170.2 C171.1 C172.1 C173.1 C174.1 D9.1 D10.1 D11.1 D12.1 D13.1 D14.1 DP1.3-8 DP2.3-8 DP3.3-8 DP4.3-8 DP5.3-8 DP8.3 DP9.3 DP10.3 DP12.3-8 DP13.3-8 DP14.3-8 DP17.3 DP18.3 DP19.3 HDMI1.2 HDMI1.5 HDMI1.8 HDMI1.11 HDMI1.17 HDMI1.20 J1.3 LED1.1 LED2.1 LED3.1 LED4.1 NOREF.1 NOREF#2.1 NOREF#3.1 NOREF#4.1 Q3.2 Q4.2 Q5.2 Q6.2 R1.1 R3.1 R9.1 R10.1 R13.1 R16.1 R18.1 R21.1 R22.1 R25.1 R29.1 R30.2 R33.2 R36.2 R37.1 R48.2 R51.1 R52.2 R55.2 R58.2 R62.2 R66.1 R67.1 R68.1 R72.2 R74.2 R85.2 R89.2 R92.2 U1.8 U1.14 U1.22 U1.63 U1.69 U3.2 U3.16 U5.2 U6.2 U7.40 U7.77 U8.2 U9.2 U10.2 U11.29 U11.41 U12.4 U13.2 U14.4 U15.29 USB1.15 USB1.16 USB1.17 USB1.18 USB1.A1 USB1.A12 USB1.B1 USB1.B12 USB2.15 USB2.16 USB2.17 USB2.18 USB2.A1 USB2.A12 USB2.B1 USB2.B12 USB4.4 USB4.7 USB4.10 USB4.11 USB5.4 USB5.7 USB5.10 USB5.11 USB6.4 USB6.7 USB6.10 USB6.11 X1.2 X1.4 X2.2 X2.4

Pads without a net: DP14 1 2 9 10; HDMI1 13 14; U1 12 13 15 16 26 27 28 29 30 31 34 35 36 41 56 57; U3 7 10 15; U7 1 3 29 30 36 75; U11 31; USB2 A2 A3 A8 A10 A11 B2 B3 B8 B10 B11

## Via types
v1: diameter 0.45, hole 0.3, Top Layer to Bottom Layer, 14 vias
v2: diameter 0.45, hole 0.299, Top Layer to Bottom Layer, 379 vias
v3: diameter 0.6, hole 0.299, Top Layer to Bottom Layer, 58 vias
v4: diameter 0.61, hole 0.305, Top Layer to Bottom Layer, 26 vias

## Routing (per net, layer and track width the routed paths; a pad name or vN(x,y) marks a point on that pad's centre or on a via; arc(x,y) is an arc through that point)
AGND: length 379.5
  Top Layer w0.178: v4(17.6,8.33) 16.55,8.33 15.54,9.34 U3.16 ; C26.1 12.76,13.49 v4(12.49,13.22) 12.72,12.98 12.72,11.14 ; C32.2 14.85,20.42 D14.1 13.61,21.31 v4(13.46,21.46) LED4.1
  Top Layer w0.18: v2(54.59,33.13) 54.1,32.64 C97.1 ; v3(17.58,48.3) 17.6,48.28 v3(17.6,47.61) ; v2(35.39,45.5) DP4.3-8 v2(38.29,45.5) ; X1.2 55.46,38.64 56.56,39.74 ; v2(21.64,41.9) 21.69,41.85 25.99,41.85 ; U1.69 24.79,39.84 U1.22 ; U11.29 67.06,13.74 66.07,14.73 U11.41 ; 22.44,39.45 24.39,39.45 ; U1.63 25.19,43.75 v2(24.53,43.09) ; U7.40 48.98,30.98 U7.77 ; USB1.B1 5.97,26.73 6.32,26.39 7.06,26.39 USB1.A12 ; DP2.3-8 45.91,20.51 v2(45.9,20.51) ; v2(43.39,46.7) DP5.3-8 v2(43.39,44.85) ; DP14.3-8 11.1,28.11 v2(9.85,28.11) ; v2(39.98,50.64) v2(41.48,50.64) v2(42.98,50.64) 44.47,50.64 v2(44.48,50.64) ; USB1.B12 6.08,32.23 6.53,32.68 USB1.18 7.16,32.79 USB1.A1 7.17,31.97 8.01,31.97 8.34,32.3 DP19.3
  Top Layer w0.203: C24.1 12.78,17.88 v4(12.78,16.97) 12.77,16.96 C25.1 12.77,15.15 v4(12.75,15.13) 12.76,15.12 C26.1
  Top Layer w0.254: C33.1 6.02,17.06 v4(5.65,17.43) ; 26.47,55.65 USB2.B12 26.47,53.65 26.22,53.4 USB2.A1 26.22,51.72 ; 20.97,55.69 USB2.B1 20.97,53.76 20.72,53.51 USB2.A12 20.72,52.28 v3(20.27,51.83) ; C23.1 7.2,8.43 v4(7.2,8.33) ; LED3.1 24.65,2.17 v4(24.09,1.61) ; C26.1 13.79,14.22 v4(13.8,14.23) 13.85,14.28 C28.2 ; R29.1 v4(3.58,7.62)
  Top Layer w0.305: HDMI1.8 v2(42.98,50.64) ; R36.2 23.99,17.93 v4(23.72,17.93) 23.33,18.32 C30.1 ; R30.2 21.71,7.41 v4(21.72,7.42) ; HDMI1.11 v2(44.48,50.64) ; USB1.17 7.16,25.93 USB1.A12 ; v2(18.36,45.9) 18.36,45.91 R3.1 ; HDMI1.5 v2(41.48,50.64) ; R22.1 v4(19.54,10.96) 19.55,10.97 R21.1 22.01,9.48 C35.1 ; C29.1 23,21.19 v4(23,21.2) 23,22.19 C45.1 23.19,22.42 C44.1 ; R89.2 15.85,30.4 v2(15.64,30.19) ; v2(38.14,20.71) 38.12,20.69 DP3.3-8 ; LED1.1 58.77,58.13 v2(59.43,57.47) ; R74.2 66.66,8.13 v2(66.91,7.88) ; DP8.3 55.32,52.02 v2(54.22,52.02) ; v2(14.11,48.49) 14.26,48.34 C169.2 ; U6.2 29.09,23.44 v4(30.07,22.46) ; v4(23.31,15.13) 23.04,15.4 C31.1 ; C47.1 v4(32.55,19.37) 33.57,19.37 C48.1 ; DP9.3 42.22,18.7 44.49,16.43 44.49,11.99 ; R52.2 53.37,30.68 v2(53.05,31) ; HDMI1.2 v2(39.98,50.64) ; C171.1 29.4,26.01 v4(29.42,25.99)
  Top Layer w0.381: C93.1 v2(50.3,25.15) ; C96.1 v2(51,21.28) ; v2(72.65,18.02) 72.77,18.15 72.77,19.35 ; v3(13.93,50.96) D12.1 16.85,50.96 17.69,50.12 DP17.3 ; X1.4 56.56,40.1 54.79,41.87 v2(54.08,41.87) 53.25,41.05 C121.1 ; C31.1 23,16.34 C29.1 ; v2(62.31,41.12) DP1.3-8 v2(58.88,41.12) ; C149.1 72.53,12.89 v2(72.55,12.86) 72.68,13 X2.4 ; 74.57,14.4 75.37,14.4 v2(75.56,14.21) v2(75.56,13.5) ; C122.1 v2(57.58,36.1) ; C166.2 v3(2.79,42.55) ; v4(7.02,12.97) 7.02,12.74 C174.1 ; v3(8.73,48.81) 8.93,48.6 C164.2 ; v2(57.39,20.85) 57.39,21.14 C94.1 ; HDMI1.17 v2(47.48,47.15) ; U12.4 v2(72.71,2.16) ; R10.1 5.31,51.87 v3(4.79,51.87) Q4.2 ; D13.1 12.98,37.7 Q3.2 10.6,38.69 10.3,38.99 9.4,38.99 R9.1 v3(7.99,38.96) ; v4(5.63,9.86) 6.39,10.62 R25.1 ; v3(23.11,33.35) R66.1 27.57,33.35 R68.1
  Top Layer w0.508: C143.1 62.58,8.04 C142.1 v2(63.21,8.01) ; C154.1 75.4,10.51 v2(75.4,9.58) C155.1 ; C139.1 71.38,8.84 v2(72.31,8.84) 73.16,8.84 ; USB5.10 42.54,13.94 DP10.3 ; C98.1 55.43,30.68 R52.2 ; R55.2 53.83,32.51 C97.1 ; LED2.1 v2(42.01,2.15) ; R51.1 57.01,35.67 C122.1 ; 74.57,14.4 74.74,14.57 C150.1 ; C169.2 14.28,47.62 C170.2 ; C34.2 18.8,11.85 18.55,11.6 18.55,10.96
  Bottom Layer w0.18: DP12.3-8 v2(12.43,26.69) ; R18.1 v2(11.29,46.97) ; C100.1 63.23,55.91 ; v2(12.99,31.14) 11.17,31.14 DP13.3-8
  Bottom Layer w0.254: v2(21.64,41.9) 21.19,41.9 20.98,41.69 18.69,41.69 18.66,41.72
  Bottom Layer w0.305: C151.1 65.24,27.83 65.61,28.19 v2(68.12,28.19) ; U13.2 34.59,5.93 C158.1 ; v2(38.14,20.71) 38.14,18.51 C87.1 ; 32.51,19.41 32.51,18.59 32.87,18.22 C88.1 ; U8.2 33.73,22.98 v2(33.29,22.54) ; C167.1 57.87,31.16 v2(57.62,31.41)
  Bottom Layer w0.381: 14.2,41.73 14.66,41.73 15.08,42.15 R37.1 ; 14.2,41.73 v3(14.88,41.05) ; 14.2,41.73 Q6.2 ; v4(5.63,9.86) 14.75,9.86 16.28,8.33 v4(17.6,8.33) 17.6,9.8 17.97,10.17 19.37,10.17 19.54,10.34 v4(19.54,10.96) ; v2(70.82,53.5) 70.8,53.48 C102.2 ; U5.2 21.97,20.17 v4(23,21.2) 23.05,21.14 25.95,21.14 26.92,20.17 R48.2 ; C128.2 71.46,15.71 72.14,15.71 72.65,16.21 v2(72.65,18.02) ; v2(59.27,14.33) 60.16,14.33 60.2,14.37 C147.1 ; v2(75.56,14.21) 75.46,14.11 C127.2 ; v3(23.11,33.35) 26.03,33.35 C11.2 30.33,33.31 C15.1 ; Q5.2 7.3,48.71 R13.1 8.7,48.84 v3(8.73,48.81) ; 7.97,40.36 7.97,38.97 v3(7.99,38.96) ; C75.1 v2(44.54,42.38) ; C85.1 52.65,30.6 v2(53.05,31) ; C133.2 72.13,12.45 v2(72.55,12.86) ; U14.4 52.94,20.5 52.15,21.28 v2(51,21.28) ; 69.96,58.05 v2(70.83,58.05) ; v2(59.27,17.61) 60.19,17.61 C130.1 ; C51.2 18.66,39.2 18.27,39.59 v3(18.27,39.9) ; DP18.3 v2(26.33,57.63) ; C81.1 v2(46.28,42.35) ; U10.2 52.43,6.65 C109.1
  Bottom Layer w0.508: C137.2 68.77,7.93 68.82,7.88 C145.2 ; C135.2 72.02,18.02 v2(72.65,18.02) ; C102.2 69.95,51.64 C104.1 ; R62.2 v2(46.15,6.24) v2(46.15,8.08) 46.15,8.4 C108.1 ; 28.44,49.1 28.44,50.16 28.46,50.17 ; C92.1 54.35,32.63 C78.1 C79.1 ; 18.66,44.23 18.66,39.2 ; C110.1 v2(54.29,5.57) C109.1 ; v4(13.46,21.46) 14.03,20.89 R33.2 15.6,20.75 C39.1 ; 42.57,26.64 45.97,26.64 ; 42.57,26.64 C73.1 ; 42.57,26.64 v2(42.93,26.28) ; C162.1 v2(28.42,7.6) v2(28.42,5.81) 28.42,5.07 R85.2 ; C167.1 56.28,30.08 C168.1 ; 65.84,55.42 64.63,55.42 64.14,55.91 v2(62.4,55.91) 61.6,55.91 C99.1 ; 28.51,49.1 30.22,49.1 ; C85.1 52.64,30.22 C86.1 ; 26.11,49.1 v3(26.11,50.22) ; 26.11,49.1 28.44,49.1 ; 26.11,49.1 25.15,49.1 ; C130.1 C125.1 v2(60.2,13.55) C126.1 v2(60.2,11.9) C148.1 ; C158.1 35.69,4.85 v2(36.44,4.85) C159.1 ; C5.2 24.37,38.07 v2(24.37,38.86) C22.2 ; v3(13.46,19.14) 13.59,19.27 C40.1 ; 37.71,38.1 37.71,38.28 37.42,38.57 C13.1 C120.1 ; 37.71,38.1 C72.1 ; 37.71,38.1 v3(38.29,38.1) ; 71.4,15.76 C133.2 ; 31.96,50.07 31.95,50.06 31.95,49.1 ; C124.1 69.12,20.45 v2(69.74,21.07) 69.74,19.73 69.09,19.08 C123.1 ; D9.1 63.99,48.04 C103.2 59.48,48.26 USB4.11 ; 31.95,49.09 31.95,49.1 ; 31.95,49.1 30.25,49.1 ; 31.95,49.1 32.02,49.17 ; 30.22,49.13 30.22,50.11 30.19,50.14
  Bottom Layer w0.737: C74.1 47.98,41.53 C75.1 C80.1
  vias: v2(2.17,22) v2(2.17,20.94) v2(2.96,22.8) v2(2.97,19.89) v2(4.05,22.8) v2(4.06,19.89) v2(9.13,56.13) v2(10.1,56.13) v2(15.49,34.49) v2(16.17,34.49) v2(16.81,35.5) v2(16.81,34.78) v2(24.53,41.85) v2(24.53,40.67) v2(24.53,39.62) v2(25.87,43.09) v2(25.87,41.85) v2(25.87,40.67) v2(25.87,39.62) v2(27.2,43.09) v2(27.2,41.85) v2(27.2,40.67) v2(27.2,39.62) v2(28.53,43.09) v2(28.53,41.85) v2(28.53,40.67) v2(28.53,39.62) v2(33.71,10.79) v2(34.51,10.79) v2(43.93,35.79) v2(43.93,34.38) v2(43.93,32.98) v2(45.05,35.79) v2(45.05,34.38) v2(45.05,32.98) v2(46.17,35.79) v2(46.17,34.38) v2(46.17,32.98) v2(47.29,35.79) v2(47.29,34.38) v2(47.29,32.98) v2(52.78,12.53) v2(52.78,11.93) v2(54.52,36.96) v2(54.52,35.02) v2(64.43,15.7) v2(64.43,14.72) v2(64.43,13.54) v2(65.28,15.7) v2(65.28,14.72) v2(65.28,13.54) v2(66.13,15.7) v2(66.13,14.72) v2(66.13,13.54) v2(66.97,15.7) v2(66.97,14.72) v2(66.97,13.54) v2(68.12,32.74) v2(68.12,31.37) v2(68.12,29.67) v2(69.75,32.74) v2(69.75,31.37) v2(69.75,29.67) v2(69.74,28.19) v3(8.16,55.06) v3(8.16,54.11) v3(11.01,55.06) v3(11.01,54.11) v3(20.97,55.7) v3(26.22,51.83) v3(26.47,55.69) v3(28.46,50.22) v3(30.19,50.22) v3(31.96,50.22)
AVDD1.2: length 21.5
  Top Layer w0.18: U7.7 40.51,35.38 v2(40.51,35.36) ; v2(40.64,31.38) 41.38,31.38 U7.17 ; U7.4 40.41,36.58 v2(40.35,36.64) ; U7.70 44.58,39.1 ; U7.22 43,29.76 v2(43,29.02) ; U7.60 v2(48.58,39.18) ; LD1.1 54.86,22.73 57.08,24.96 L5.2
  Top Layer w0.203: U7.39 50.39,30.58 50.45,30.52 50.45,28.79 52.22,27.01 R49.1
  Bottom Layer w0.254: C73.2 43,28.63 v2(43,29.02) ; C75.2 44.58,40.09 v2(44.58,39.12)
  Bottom Layer w0.305: v2(40.64,31.38) 40.38,31.64 C72.2 ; C49.2 39.92,35.12 40.16,35.36 v2(40.51,35.36) ; C76.2 39.99,36.88 40.23,36.64 v2(40.35,36.64)
  Bottom Layer w0.381: v2(48.58,39.18) 48.58,39.61 C74.2
  vias: v2(55.3,23.58) v2(55.97,23.62) v2(55.96,22.84) v2(56.63,23.61)
DVDD1.2: length 26.1
  Top Layer w0.18: U7.47 50.19,33.8 v2(51.17,33.8) ; U7.28 45.38,29.78 v2(45.38,30.54)
  POWER w0.18: v2(50.15,23.22) v2(50.15,23.89) 50.58,23.89 v2(50.78,24.09) 51.39,24.09 v2(51.4,24.08) 51.4,30.24 50.9,30.74 ; 50.9,30.74 51.17,31.01 v2(51.17,33.8) ; 50.9,30.74 49.58,30.74 48.81,31.51 46.35,31.51 v2(45.38,30.54)
  Bottom Layer w0.254: C78.2 52.44,36.06 51.94,35.56 51.94,34.56 v2(51.17,33.8) ; v2(45.38,30.54) 45.97,29.94 C77.2
PGND: length 18.9
  Top Layer w0.762: 65.81,35.97 65.81,22.44 ; 65.81,35.97 65.81,37.92 ; 65.81,35.97 65.63,35.79 62.51,35.79
VBUS_D_DIS: length 22.7
  Top Layer w0.18: 26.79,45.4 26.79,46.28 v2(26.83,46.32)
  Bottom Layer w0.18: v2(26.83,46.32) 26.64,46.13 23.11,46.13 20,49.24 14.12,49.24 13.38,48.5 13.38,46.7 13.72,46.36 13.72,45.4 14.05,45.07 Q6.1
  Bottom Layer w0.254: Q6.1 15.53,43.63 R37.2
VBUS_D_EN: length 29.9
  Top Layer w0.18: R9.2 11.86,40.46 Q3.1 12.22,40.59 v2(12.88,41.24) ; v2(27.54,46.82) 27.54,46.24 27.19,45.89 27.19,45.4
  Bottom Layer w0.18: v2(27.54,46.82) 26.34,46.82 26.01,46.49 23.49,46.49 20.18,49.8 13.83,49.8 12.87,48.84 12.87,46.36 13.3,45.93 13.3,44.29 13.05,44.04 13.05,41.41 v2(12.88,41.24)
VBUS_DFP: length 26.7
  Top Layer w0.18: Q1.8 12.37,47.9 11.72,48.55 C164.1
  Top Layer w0.254: USB2.B9 v3(24.97,55.72) ; USB2.A4 24.72,52.3 24.83,52.19 v3(24.83,51.8) ; USB2.B4 v3(22.47,55.7) ; USB2.A9 22.22,51.79
  POWER w0.381: 22.22,50.98 19.51,50.98 17.13,53.35 v3(16.25,53.35) ; 22.22,50.98 24.53,50.98 24.83,51.28 v3(24.83,51.8) 24.83,53.43 24.97,53.56 v3(24.97,55.72) ; 22.22,50.98 v3(22.22,51.83) 22.19,51.86 22.19,53.62 22.47,53.89 v3(22.47,55.7)
  vias: v3(12.78,45.51) v3(12.78,44.58) v3(15.14,55.71) v3(15.13,53.35) v3(16.25,55.71) v3(16.25,54.92) v3(16.25,54.14)
VBUS_FB_D: length 19.6
  Top Layer w0.18: 23.99,45.4 23.99,47.46 23.58,47.87 21.66,47.87 20.87,47.08 16.22,47.08 C169.1 15.66,47.69 13.59,49.76 v2(13.06,49.76)
  Bottom Layer w0.18: v2(13.06,49.76) 11.95,49.76 11.29,49.09 R18.2 9.7,47.74 R17.1
VBUS_FB_U: length 22
  Top Layer w0.18: 23.59,45.4 23.59,47.14 23.35,47.38 21.71,47.38 20.98,46.66 16.45,46.66 C170.1 15.68,45.84 13.28,43.44 v2(9.67,43.44)
  Bottom Layer w0.18: v2(9.67,43.44) 9.38,43.44 7.97,42.04 R15.1 7.97,41.85 6.52,40.4 6.52,40.37
VBUS_HUB: length 22
  Top Layer w0.152: v3(8.33,45.72) v3(8.33,46.41) 8.33,47.06 7.32,48.07 R7.1 ; v3(8.33,45.72) Q2.3 ; v3(8.33,45.72) 8.43,45.61 Q1.2 ; R6.1 8.34,42.6 v3(8.34,45.07) 7.46,45.07 Q2.2
  Top Layer w0.178: 10.75,16.07 9.72,16.07 9.02,15.37 R23.2 ; 10.75,16.07 10.75,14.23 C26.2 10.74,14.2 10.74,13.12 11.83,12.03 U3.3 ; 10.75,16.07 C25.2 ; 10.75,16.07 C24.2 10.75,19.88 D14.2
  vias: v1(8.24,21.88) v1(8.23,21.25) v1(8.94,21.87) v1(8.92,21.25) v1(9.58,21.87) v1(9.6,21.25) v1(10.28,21.87) v1(10.25,21.25)
VBUS_IN: length 8.4
  Top Layer w0.18: R50.1 55.5,32.52 R51.2 53.89,34.08 53.87,34.06 52.26,35.66 52.26,36.4 52.08,36.58 U7.54
VBUS_U_DIS: length 24.1
  Top Layer w0.18: v2(22.03,49.24) 24.2,49.24 25.99,47.44 25.99,45.4
  Bottom Layer w0.18: Q5.1 6.47,50.61 6.78,50.3 7.39,50.3 R13.2 20.66,50.34 21.76,49.24 v2(22.03,49.24)
VBUS_U_EN: length 27.7
  Top Layer w0.18: 26.39,45.4 26.39,47.52 24,49.91 v2(22.03,49.91) ; 6.88,51.49 5.55,50.16 R10.2
  Top Layer w0.254: Q4.1 5.33,49.97 R10.2
  Bottom Layer w0.18: v2(22.03,49.91) 21.13,50.81 15.34,50.81 14.48,51.67 13.64,51.67 12.73,50.76 8.61,50.76 7.88,51.49 v2(6.88,51.49)
VBUS_UFP: length 19.3
  Top Layer w0.254: 5.77,30.73 v3(4.73,30.73) ; 7.17,30.48 v3(8.06,30.48) ; 5.77,28.23 v3(4.7,28.23) ; v3(8.06,27.91) 7.98,27.98 7.17,27.98
  POWER w0.254: 6.57,30.31 6.75,30.48 6.56,30.48
  POWER w0.305: 6.56,30.48 6.31,30.73 v3(4.73,30.73) ; v3(8.06,27.91) 6.9,27.91 6.57,28.23 ; v3(10.58,35.53) 10.58,35.16 8.06,32.64 v3(8.06,30.48) 6.75,30.48 ; v3(4.7,28.23) 6.57,28.23 ; 6.57,28.23 6.57,30.31
  vias: v3(4.72,43) v3(5.41,43) v3(6.1,42.99) v3(8.37,37.24) v3(8.37,36.34) v3(9.07,37.24) v3(9.8,37.24) v3(10.57,37.24) v3(10.61,36.34)
VDD1.0: length 100.1
  Top Layer w0.18: v2(21.64,38.02) 21.87,38.25 22.44,38.25 ; v2(25.25,46.99) 25.59,46.64 25.59,45.4 ; v2(24.7,36.45) 24.45,36.71 24.45,36.97 24.39,37.02 U1.21 ; 29.59,45.4 29.59,45.94 30.05,46.4 30.05,46.55 30.07,46.58 ; v2(33.54,41.14) 33.39,40.98 30.4,40.98 U1.42 ; v2(32.98,41.42) 32.96,41.44 U1.43 ; v2(21.64,43.01) 21.68,43.05 22.44,43.05 ; 29.19,45.4 29.19,46.06 29.45,46.32 v2(29.45,46.58)
  Top Layer w0.508: R76.1 66.11,3.87 64.41,2.18 59.9,2.18 59.46,2.62 59.46,6.42 v2(59.48,6.43)
  POWER w0.18: v2(22.94,27.58) v2(22.94,26.84) v2(22.94,26.14) ; v2(21.64,43.01) 25.25,46.62 v2(25.25,46.99) 25.66,47.41 29.09,47.41 29.22,47.28 29.22,46.81 v2(29.45,46.58)
  POWER w0.508: 21.64,42.98 v2(21.64,43.01) ; 21.4,39.93 v2(21.64,39.69) v2(21.64,38.02) 21.64,37.84 22.15,37.32 23.83,37.32 ; v2(59.48,6.43) 59.48,6.54 56.63,9.39 42.59,9.39 42.23,9.75 42.23,16.01 41.38,16.86 27.81,16.86 27.17,17.5 27.17,21.33 25.21,23.3 25.21,24.05 23.12,26.14 v2(22.94,26.14)
  Bottom Layer w0.18: v2(24.7,36.45) 26.07,35.08 C11.1
  Bottom Layer w0.381: v2(21.64,43.01) 21.19,42.56 C18.1 ; v2(25.25,46.99) 25.25,47.55 C27.1 ; C22.1 v2(21.64,39.69) ; 22.94,38.02 v2(21.64,38.02)
  vias: v2(23.83,27.58) v2(23.83,26.84) v2(23.83,26.14) v2(30.07,46.58) v2(59.48,5.68)
VDD1.2: length 19.8
  POWER w0.18: v2(35.3,30.99) 34.65,30.34 34.65,27.02 36.43,25.23 46.67,25.23 v2(48.62,27.18)
  vias: v2(35.3,31.63) v2(36.03,31.63) v2(36.02,31) v2(48.61,27.89)
VDD1.8: length 4.1
  Top Layer w0.18: 22.44,40.65 21.66,40.65 v2(21.64,40.62)
  Bottom Layer w0.381: v2(21.64,40.62) 21.42,40.84 C50.1
  Bottom Layer w0.508: C50.1 20.13,40.83 C51.1
VDD3.3: length 240.8
  Top Layer w0.178: R35.2 27.31,19.47 v2(30.62,19.47) 30.62,20.59 30.74,20.71 31.61,20.71 C47.2 31.72,20.72 34.39,20.72 34.73,21.06 L2.2 34.73,25.52 R43.2 32.69,27.1 C171.2
  Top Layer w0.18: v2(28.77,46.26) 28.79,46.24 28.79,45.4 ; 23.19,37.5 23.19,36.61 v2(23.11,36.53) ; 19.1,40.68 19.1,40.99 19.83,41.73 19.83,42.68 20.57,43.42 v2(20.97,43.42) 21,43.45 22.44,43.45 ; v2(66.5,57.24) 66.17,57.57 v2(62.04,57.57) ; U1.37 30.95,39.04 31.41,38.58 ; 28.39,45.4 28.39,46.01 28.16,46.24 ; U1.4 v2(23.12,43.44)
  Top Layer w0.305: C154.2 76.8,10.51 C155.2 77.47,8.75 78.1,8.12 U12.8 U12.7 76.67,4.69 76.65,4.71 74.84,4.71 73.56,3.43 U12.3
  Top Layer w0.381: C173.2 17.79,36.71 C172.2 ; C172.2 17.99,36.75 R91.2 19.64,35.12 v3(22.48,35.12) ; C172.2 17.83,37.17 v2(17.54,37.45)
  POWER w0.18: v2(28.77,46.26) v2(28.16,46.26) 28.16,45.45 ; 30.36,39 30.79,38.58 v2(31.42,38.58) 30.5,37.66 30.5,25.31 29.38,24.19 29.38,19.99 v2(29.91,19.46) ; 30.36,39 30.36,43.25 28.16,45.45 ; 30.36,39 30.36,38.99 26.5,35.12 v3(22.48,35.12) ; v2(23.12,43.44) 24.9,45.22 27.93,45.22 28.16,45.45 ; v2(62.04,57.57) 56.94,52.47 56.94,46.85 58.13,45.66 v2(58.13,33.33) 58.06,33.26 58.06,18.85 56.87,17.66 44.27,17.66 40.57,21.36 32.5,21.36 v2(30.62,19.47)
  Bottom Layer w0.18: C21.2 C20.2 28.51,46.61 v2(28.16,46.26) ; U15.22 17.41,37.32 v2(17.54,37.45)
  Bottom Layer w0.305: v2(52.65,4.98) 52.65,4.58 R60.1 ; v2(58.13,33.33) 58.69,32.78 58.69,29.5 C167.2 ; v2(27.18,6.45) 27.18,3.93 27.59,3.52 R84.2 ; R83.1 35.61,2.03 34.86,1.28 33.53,1.28 32.88,1.94 v2(32.88,6.49)
  Bottom Layer w0.381: 33.31,38.58 31.42,38.58 v2(31.42,38.58) ; C167.2 57.84,28.72 C168.2 56.25,27.8 56.75,27.3 U14.8 ; v2(62.04,57.57) 62.79,57.57 R56.1 ; v2(23.11,36.53) 23.11,35.15 23.13,35.12 ; 23.13,35.12 23.63,34.63 24.27,34.63 C10.1 ; 23.13,35.12 v3(22.48,35.12) ; v2(22.44,6.84) 23.15,6.84 23.74,7.43 23.74,13.11 25.57,14.94 v2(25.57,17.03) ; v2(20.97,43.42) 20.11,44.28 ; U14.8 U14.7 ; U14.8 56.75,24.45 58.14,23.06 58.14,19.51 57.87,19.24 57.78,19.24 57.51,18.97 57.51,18.75 57.78,18.48 57.87,18.48 58.14,18.21 58.14,17.7 57.87,17.43 54.58,17.43 54.21,17.81 U14.3 ; v2(43.78,5.25) 44.69,4.34 45.77,4.34 R61.2 ; R57.2 v2(66.5,57.24)
  vias: v2(22.43,6.15) v2(23.25,6.81) v2(23.27,6.15) v2(25.57,17.67) v2(26.23,17.67) v2(26.22,17.03) v2(29.92,18.83) v2(30.63,18.86) v2(64.14,4.16) v2(64.14,3.52) v2(78.95,8.67) v2(78.95,8.03) v2(78.95,7.37) v2(78.95,6.71)
VDD5.0: length 200.9
  Top Layer w0.178: C32.1 19.04,16.77 R19.2 ; C34.1 18.8,16.53 17.62,15.35 17.62,13.02 15.55,10.94 U3.20 ; U6.4 24.53,24.39 23.94,23.8 C45.2 23.19,23.82 C44.2 20.52,23.82 R88.2 ; C29.2 21,16.34 C31.2 21.04,15.44 20.42,14.82 C38.2
  Top Layer w0.18: v2(28.59,36.45) 28.79,36.65 U1.32 ; 29.2,36.45 29.2,37.48 U1.33 ; R50.2 v2(57.59,32.47) ; v2(67.05,10.43) 66.74,10.73 66.74,11.27 66.26,11.75 U11.27 ; U11.21 63.86,11.58 v2(63.16,10.88) ; R20.2 21.96,14.04 C38.2 C34.1
  Top Layer w0.203: R88.2 19.14,20.05 C32.1
  Top Layer w0.381: v4(4.56,8.53) 4.57,8.54 R28.1 ; R27.1 4.55,15.55 v4(4.54,15.56)
  POWER w0.18: 28.46,21.34 28.46,18.04 28.59,17.91 34.32,17.91 v2(35.6,19.2) v2(35.6,19.96) ; v2(29.2,36.45) v2(28.59,36.45) 28.59,31.66 27.71,30.77 27.71,29.47 v2(27.34,29.1) 26.65,29.1 v2(26.65,29.11) ; v2(19.13,18.43) 18.86,18.16 18.86,6.79 18.73,6.66 18.03,6.66 17.18,7.51 5.58,7.51 v4(4.56,8.53) ; v2(55.85,54.65) 55.82,54.65 55.52,54.34 55.52,45.9 v2(55.65,45.77) 53.5,45.77 53.24,46.03 33.57,46.03 30.14,49.46 23.45,49.46 19.43,45.44 18.01,45.44 17.88,45.31 17.88,42.01 16.23,40.37 16.23,39.31 16.53,39.01 16.53,36.54 17.49,35.59 17.49,33.84 16.99,33.35 16.99,24.92 v2(19.93,21.98) 19.89,21.93 19.89,20.96 v2(19.14,20.22)
  Bottom Layer w0.18: v2(55.65,45.77) 55.65,43.09 58.31,40.42 58.31,35.99 57.59,35.27 v2(57.59,32.47)
  Bottom Layer w0.305: R46.1 34.05,21.83 34.68,21.2 U8.4
  Bottom Layer w0.381: C99.2 61.64,54.47 65.84,54.47 ; D1.2 48.41,55.09 48.88,55.56 49.12,55.56 ; v2(49.12,54.65) v2(49.12,55.48)
  Bottom Layer w0.508: C145.1 70.24,9.28 70.75,8.77 70.75,6.75 69.52,5.52 v2(69.52,2.2)
  vias: v2(18.51,20.2) v2(18.5,18.43) v2(19.93,21.35) v2(26.65,28.5) v2(34.94,19.97) v2(34.93,19.22) v2(37.76,2.49) v2(37.76,1.29) v2(38.44,2.49) v2(38.44,1.29) v2(55.85,55.33) v2(55.76,4.04) v2(55.76,3.39) v2(55.76,2.77) v2(56.45,55.33) v2(56.45,54.65) v2(56.51,4.04) v2(56.51,3.39) v2(56.5,2.77) v2(68.84,1.58) v2(68.87,2.19) v2(69.52,1.58)
VDDB3.3: length 76
  Top Layer w0.13: U7.65 v2(46.58,39.09)
  Top Layer w0.178: R44.2 34.97,27.38 R43.1
  Top Layer w0.18: v2(40.84,33.38) 41.38,33.38 U7.12 ; v2(49.46,32.74) 49.63,32.58 U7.44 ; U7.73 43.38,38.02 v2(43.42,37.97) ; U7.55 51.23,36.98 51.38,37.13 51.77,37.13 v2(51.87,37.03) ; v2(45.2,29.03) 44.98,29.24 U7.27
  Top Layer w0.305: v2(53.25,29.48) 53.71,29.03 R54.1
  Top Layer w0.508: R54.1 53.83,29.14 R53.2
  POWER w0.18: 43.84,37.56 43.66,37.56 41.66,35.55 41.66,31.41 41.79,31.29 42.33,31.29 43.62,30 44.23,30 v2(45.2,29.03) ; 43.84,37.56 51.34,37.56 v2(51.87,37.03) ; 43.84,37.56 v2(43.42,37.97) ; v2(51.87,37.03) 53.55,35.35 v2(53.55,35.01) ; v2(51.87,37.03) 51.87,30.87 v2(53.25,29.48) ; v2(49.83,25.69) 50.67,26.53 50.67,29.21 50.02,29.87 48.19,29.87 47.35,29.03 v2(45.2,29.03) ; v2(45.2,29.03) 44.19,28.02 39.8,28.02 39.46,28.36 v2(36.02,28.36)
  Bottom Layer w0.18: v2(53.55,35.01) 53.55,34.95 C84.2
  Bottom Layer w0.254: v2(45.2,29.03) 44.25,28.08 C83.2 ; C84.2 52.9,32.58 C92.2 52.68,32.74 v2(49.46,32.74)
  Bottom Layer w0.305: v2(40.84,33.38) 39.15,33.38 C82.2
  Bottom Layer w0.381: C81.2 46.58,39.85 v2(46.58,39.09) ; C80.2 43.42,39.49 v2(43.42,37.97) ; v2(49.83,25.69) 49.83,26.04 R87.1 ; v2(51.87,37.03) 52.16,37.03 C79.2
  vias: v2(36.03,29.95) v2(36.02,29.12) v2(36.02,27.57)
VDDC1.0: length 14.7
  Top Layer w0.18: U11.37 68.92,15.33 69.31,15.72 ; v2(69.32,14.12) 68.17,14.12 U11.34 ; v2(62.31,13.38) 62.37,13.33 U11.19 ; v2(62.31,15.32) 62.32,15.33 U11.14 ; U11.3 v2(66.66,17.87) ; v2(64.65,17.87) 64.66,17.86 U11.8
  Bottom Layer w0.305: C123.2 67.01,18.22 v2(66.66,17.87) ; C126.2 62.22,13.38 v2(62.31,13.38) ; C124.2 64.65,18.57 v2(64.65,17.87) ; 61.47,15.32 v2(62.31,15.32)
  Bottom Layer w0.381: v2(69.32,14.12) 69.34,14.11 C127.1 ; C128.1 69.37,15.77 v2(69.32,15.72)
  Bottom Layer w0.508: C125.2 61.61,16 C147.2 ; C148.2 C126.2
  vias: v2(72.04,10.85) v2(72.64,10.87) v2(73.24,10.86) v2(73.85,10.03) v2(73.85,10.65)
VDDC3.3: length 41.8
  Top Layer w0.18: v2(61.74,18.6) 63.16,17.18 U11.11 ; v2(69.13,13.42) 68.83,13.73 U11.33 ; U11.23 64.66,11.44 v2(64.7,11.39) 64.7,9.8 R73.2 ; U11.26 65.86,11.7 66.3,11.27 v2(66.3,10.89)
  Top Layer w0.381: R80.2 70.56,20.28 v2(70.35,20.28) ; v2(70.32,40.08) 71.63,40.08 R79.2
  Bottom Layer w0.203: C146.1 64.8,9.92 64.95,10.07 64.95,11.15 v2(64.7,11.39)
  Bottom Layer w0.305: C141.1 66.44,10.25 66.3,10.4 v2(66.3,10.89) ; C130.2 61.6,18.46 v2(61.74,18.6)
  Bottom Layer w0.381: v2(70.32,40.08) 70.35,40.06 70.35,37.42 70.99,36.78 70.99,20.93 v2(70.35,20.28) ; v2(69.13,13.42) 69.13,13.31 C133.1 v2(68.62,12.45)
  Bottom Layer w0.508: C135.1 70.12,17.52 v2(70.12,18.83) ; C141.1 66.46,9.3 C140.1
  vias: v2(60.2,8.99) v2(60.2,8.36) v2(60.2,7.76) v2(68.89,17.36) v2(68.89,16.75)
AMSEL: length 2.2
  Top Layer w0.18: v2(15.28,32.22) 15.28,32.19 R89.1
  Bottom Layer w0.18: U15.8 15.41,32.34 v2(15.28,32.22)
AUX_N_UFP: length 4
  Top Layer w0.13: 22.44,44.24 20.23,44.24 19.73,43.74 19.27,43.74 18.94,44.07 C7.2
AUX_P_UFP: length 4
  Top Layer w0.13: C6.2 20.29,43.84 U1.3
BB_DN: length 32.1
  Top Layer w0.18: U1.20 23.99,36.99 24.14,36.84 24.14,36.23 23.57,35.66 22.24,35.66 21.6,36.3 v2(21.6,36.31)
  Bottom Layer w0.13: R70.2 30.53,52.34 30.53,51.76 31.48,50.82 32.63,50.82 33.28,50.16 33.28,46.88 29.77,43.37 29.77,37.81 29.27,37.31 22.18,37.31 21.6,36.73 v2(21.6,36.31)
BB_DP: length 30.3
  Top Layer w0.18: U1.19 23.59,36.95 23.73,36.81 23.73,36.5 23.32,36.09 22.44,36.09 v2(22.21,36.31)
  Bottom Layer w0.13: R69.2 30.86,52.42 30.86,51.89 31.6,51.15 32.8,51.15 33.54,50.41 33.54,46.78 30.14,43.38 30.14,37.71 29.41,36.98 22.55,36.98 22.21,36.64 22.21,36.32 v2(22.21,36.31)
CC1_DFP: length 14
  Top Layer w0.18: 20.4,49.56 21.34,50.5 23.65,50.5 24.22,51.07 USB2.A5 ; 20.4,49.56 20.16,49.56 ; 20.4,49.56 20.41,49.56 21.22,48.75 23.94,48.75 24.79,47.9 24.79,45.4
CC1_UFP: length 38.1
  Top Layer w0.18: 12.03,31.35 14.29,33.61 14.29,37.22 16.27,39.19 v2(17.3,39.19) ; 12.03,31.35 DP19.1 ; 12.03,31.35 12.78,30.6 v2(12.78,29.53) ; 22.44,44.65 21.71,44.65 21.46,44.9 v2(21.46,45.69)
  Top Layer w0.254: 5.77,28.73 4.99,28.73 4.93,28.79 4.47,28.79 4.43,28.75 v2(3.8,28.75)
  Bottom Layer w0.13: v2(12.78,29.53) 10.25,29.53 8.6,27.88 8.6,27.61 8.41,27.41 6.96,27.41 5.63,28.75 v2(3.8,28.75)
  Bottom Layer w0.18: v2(17.3,39.19) 17.23,39.26 17.23,44.17 18.2,45.13 19.83,45.13 20.13,45.43 C8.2 21.01,46.14 v2(21.46,45.69)
CC2_DFP: length 23
  Top Layer w0.18: USB2.B5 22.97,54.88 23.12,55.04 23.12,55.95 22.53,56.54 19.25,56.54 18.36,55.65 18.36,50.18 20.16,48.38 20.16,47.66 20.53,47.66 21.26,48.39 23.71,48.39 24.39,47.71 24.39,45.4
